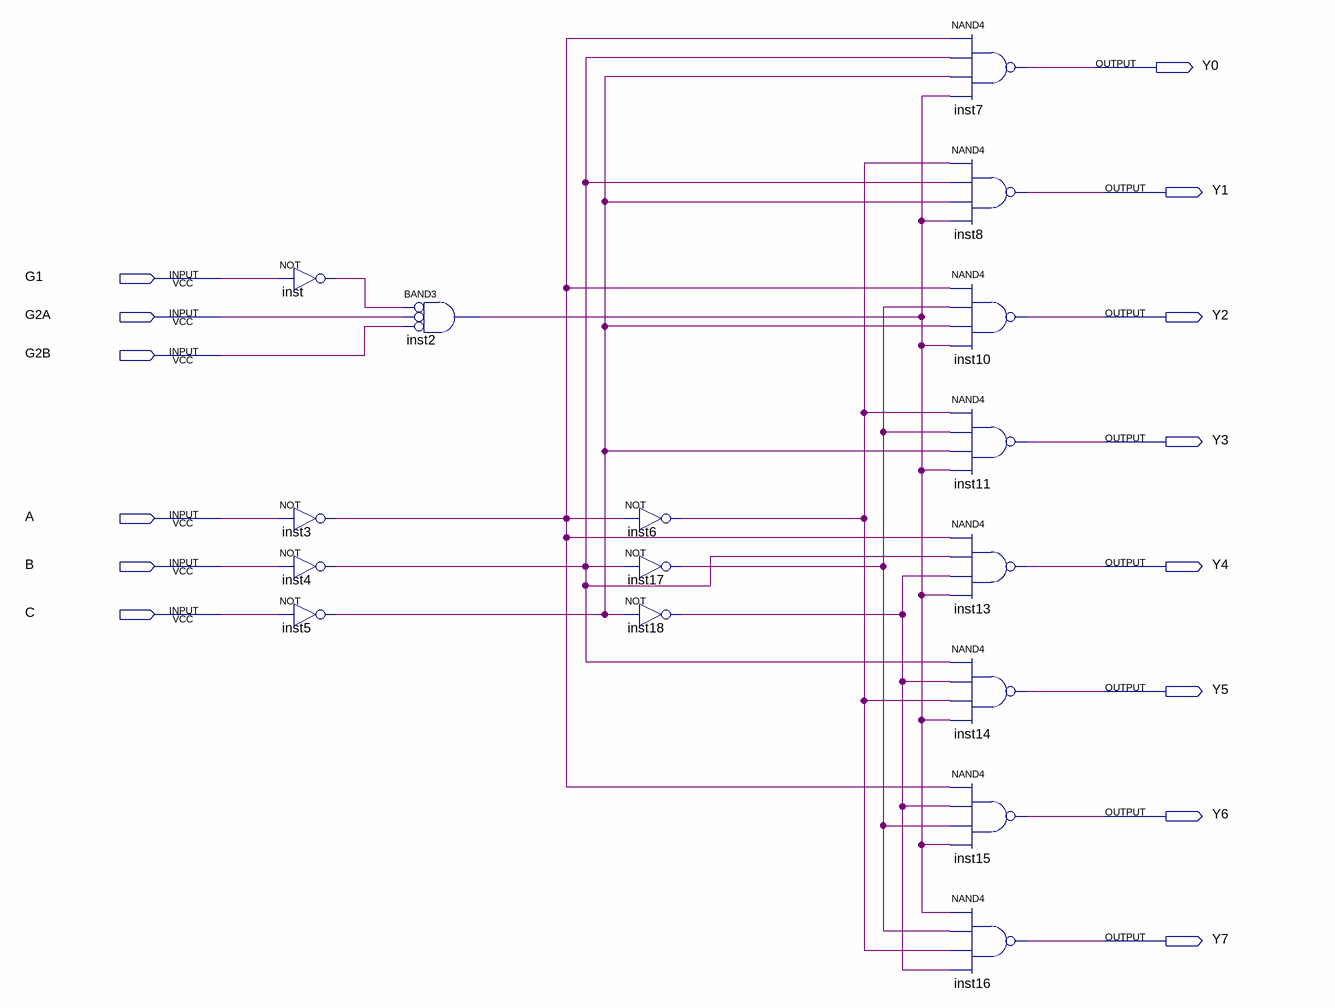
[diagram p0: schematic sheet]
// Quartus schematic 74LS138.bdf as structural Verilog: 16 symbols, 14 pins
module \74LS138  (
  input  G1,
  input  G2A,
  input  G2B,
  input  A,
  input  B,
  input  C,
  output Y0,
  output Y1,
  output Y2,
  output Y3,
  output Y4,
  output Y5,
  output Y6,
  output Y7
);

  wire inst2_out, inst3_out, inst4_out, inst5_out, inst6_out, inst17_out, inst18_out, inst_out;

  not inst (inst_out, G1);
  not inst3 (inst3_out, A);
  not inst4 (inst4_out, B);
  not inst5 (inst5_out, C);
  and inst2 (inst2_out, ~inst_out, ~G2A, ~G2B);  // BAND3
  not inst6 (inst6_out, inst3_out);
  not inst17 (inst17_out, inst4_out);
  not inst18 (inst18_out, inst5_out);
  nand inst7 (Y0, inst3_out, inst4_out, inst5_out, inst2_out);
  nand inst8 (Y1, inst6_out, inst4_out, inst5_out, inst2_out);
  nand inst10 (Y2, inst3_out, inst17_out, inst5_out, inst2_out);
  nand inst11 (Y3, inst6_out, inst17_out, inst5_out, inst2_out);
  nand inst13 (Y4, inst3_out, inst4_out, inst18_out, inst2_out);
  nand inst14 (Y5, inst4_out, inst18_out, inst6_out, inst2_out);
  nand inst15 (Y6, inst3_out, inst18_out, inst17_out, inst2_out);
  nand inst16 (Y7, inst2_out, inst17_out, inst6_out, inst18_out);
endmodule
